# EAGLE design Accelerometer Test Board (EAGLE 8.5.1)
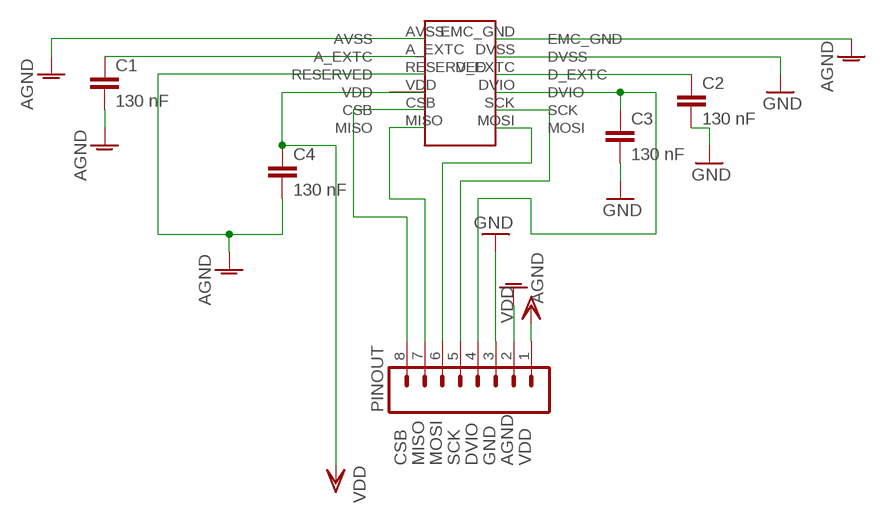
[diagram p0: schematic, sheet 1]

## Parts
C1  130 nF  CAP0805  [0805]
C2  130 nF  CAP0805  [0805]
C3  130 nF  CAP0805  [0805]
C4  130 nF  CAP0805  [0805]
PINOUT  M08  [1X08]
U$1  SCA3100-D04  [SCA3100-D04]

## Nets
AGND: C1.2 C4.2 PINOUT.2 U$1.AVSS U$1.EMC_GND U$1.RESERVED
CSB: PINOUT.8 U$1.CSB
DVIO: C3.1 PINOUT.4 U$1.DVIO
GND: C2.2 C3.2 PINOUT.3 U$1.DVSS
MISO: PINOUT.7 U$1.MISO
MOSI: PINOUT.6 U$1.MOSI
N$1: C1.1 U$1.A_EXTC
N$3: C2.1 U$1.D_EXTC
SCK: PINOUT.5 U$1.SCK
VDD: C4.1 PINOUT.1 U$1.VDD

## Library data of the parts
C1-C4 = HyTechDevices:CAP: Capacitor Standard 0603 ceramic capacitor, and 0.1" leaded capacitor.
PINOUT = HyTechDevices:M08: Standard 8-pin 0.1" header. NOTES ON THE VARIANTS LOCK and LOCK_LONGPADS... This footprint was designed to help hold the alignment of a through-hole component (i.e. 6-pin header) while soldering it into place. You may notice that each hole has been shifted either up or down by 0.005 of an inch from it's more standard position (which is a perfectly straight line). This slight alteration caused the pins (the squares in the middle) to touch the edges of the holes. Because they are alternating, it causes a "brace" to hold the component in place. 0.005 has proven to be the perfect amount of "off-center" position when using our standard breakaway headers. Although looks a little odd when you look at the bare footprint, once you have a header in there, the alteration is very hard to notice. Also,if you push a header all the way into place, it is covered up entirely on the bottom side. This idea of altering the position of holes to aid alignment will be further integrated into the Sparkfun Library for other footprints. It can help hold any component with 3 or more connection pins. Note: The Sparkfun version includes many other packages including surface mount that may be of future interest. Source: Sparkfun <https://github.com/sparkfun/SparkFun-Eagle-Libraries>
U$1 = HyTechDevices:SCA3100-D04: Murata SCA3100-D04 3-axis accelerometer Datasheet <http://www.mouser.com/pdfdocs/SCA3300-D01Industrial3-axisaccelerometerDatasheet_A1.pdf>

## Board
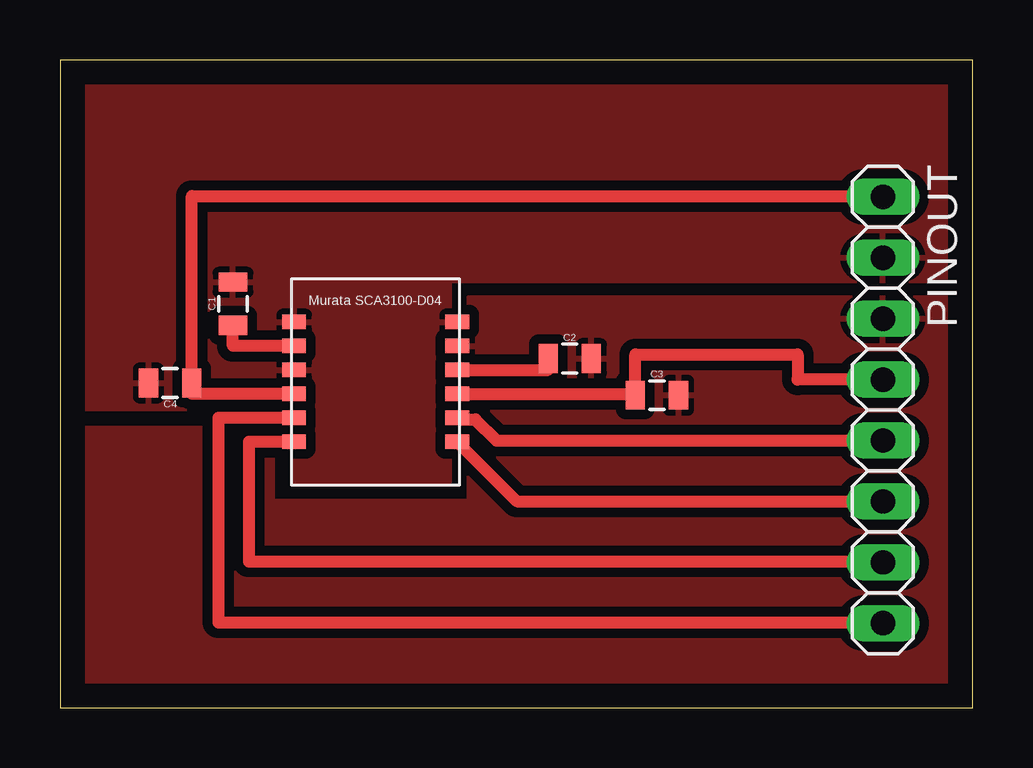
[diagram p1: board, top side]

Size 38.02 x 27.01 mm. Coordinates in mm from the lower left corner, seen from the top.
Outline: 0,0 38.02,0 38.02,27.01 0,27.01 0,0
Copper layers (1*16): Top 0.035mm / dielectric 1.5mm / Bottom 0.035mm
Design rules "default *": minimum track width 6mil, minimum drill 0.35mm, track to track 16mil, track to pad 16mil, pad to pad 16mil, via to via 16mil, smd to smd 16mil, copper to edge 40mil, drill to drill 6mil, minimum pad ring 10mil, minimum via ring 8mil, stop-mask expansion 4mil, vias tented up to drill 0mil, thermal gap 10mil

### Footprints (pad centres in the part's own frame; a part is rotated, then mirrored left to right if it is on the bottom)
0805 = smd 0.8 x 1.2: 1 -0.9,0; 2 0.9,0
1X08 = drill 1.016 long: 1 -8.89,0; 2 -6.35,0; 3 -3.81,0; 4 -1.27,0; 5 1.27,0; 6 3.81,0; 7 6.35,0; 8 8.89,0
SCA3100-D04 = smd 0.98 x 0.61: A_EXTC 0.1,-2.8; AVSS 0.1,-1.8; CSB 0.1,-5.8; D_EXTC 6.9,-3.8; DVIO 6.9,-4.8; DVSS 6.9,-2.8; EMC_GND 6.9,-1.8; MISO 0.1,-6.8; MOSI 6.9,-6.8; RESERVED 0.1,-3.8; SCK 6.9,-5.8; VDD 0.1,-4.8

### Placement (x,y rotation side)
C1  7.21,16.84 90 top
C2  21.24,14.56 0 top
C3  24.87,13.03 0 top
C4  4.59,13.54 180 top
PINOUT  34.29,12.41 270 top
U$1  9.65,17.89 0 top

### Tracks (layer width: path | path; a pad name or v marks a point on that pad's centre or on a via)
AGND
  pour Top: -0.25,12.45 9.65,12.45 9.65,9.4 16.26,9.4 16.26,17.78 38.35,17.78 38.35,27.18 -0.25,27.18
CSB
  Top 0.508: U$1.CSB 6.6,12.09 6.6,3.56 34.29,3.56 PINOUT.8
DVIO
  Top 0.508: 16.55,13.03 U$1.DVIO 23.97,13.09 C3.1 23.97,14.73 30.73,14.73 30.73,13.72 | 30.73,13.72 30.73,13.68 | 30.73,13.72 34.29,13.72 PINOUT.4
GND
  pour Top: -0.25,11.68 8.89,11.68 8.89,8.64 17.02,8.64 17.02,17.12 38.35,17.12 38.35,-0.51 -0.25,-0.51
MISO
  Top 0.508: U$1.MISO 7.87,11.09 7.87,6.1 34.29,6.1 PINOUT.7
MOSI
  Top 0.508: U$1.MOSI 19.04,8.6 PINOUT.6
N$1
  Top 0.508: U$1.A_EXTC 7.21,15.09 C1.1
N$3
  Top 0.508: U$1.D_EXTC 20.34,14.09 C2.1
SCK
  Top 0.508: U$1.SCK 16.61,12.03 17.3,12.03 18.19,11.14 PINOUT.5
VDD
  Top 0.508: U$1.VDD 5.49,13.09 C4.1 5.49,21.34 34.29,21.34 PINOUT.1